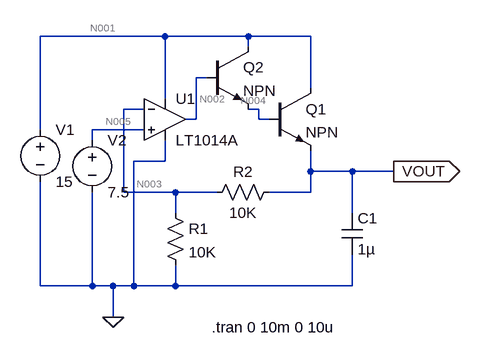
[diagram p0: schematic linear regulator.asc]
linear regulator.asc, the LTspice schematic file:
Version 4
SHEET 1 880 680
WIRE 192 16 0 16
WIRE 320 16 192 16
WIRE 416 16 320 16
WIRE 320 32 320 16
WIRE 256 80 240 80
WIRE 416 96 416 16
WIRE 192 112 192 16
WIRE 160 128 128 128
WIRE 336 128 320 128
WIRE 240 144 240 80
WIRE 240 144 224 144
WIRE 336 144 336 128
WIRE 352 144 336 144
WIRE 0 160 0 16
WIRE 160 160 80 160
WIRE 80 176 80 160
WIRE 192 208 192 176
WIRE 192 208 144 208
WIRE 416 224 416 192
WIRE 480 224 416 224
WIRE 544 224 480 224
WIRE 128 256 128 128
WIRE 208 256 128 256
WIRE 272 256 208 256
WIRE 416 256 416 224
WIRE 416 256 352 256
WIRE 208 288 208 256
WIRE 480 288 480 224
WIRE 0 400 0 240
WIRE 80 400 80 256
WIRE 80 400 0 400
WIRE 112 400 80 400
WIRE 144 400 144 208
WIRE 144 400 112 400
WIRE 208 400 208 368
WIRE 208 400 144 400
WIRE 480 400 480 352
WIRE 480 400 208 400
WIRE 112 448 112 400
FLAG 112 448 0
FLAG 544 224 VOUT
IOPIN 544 224 Out
SYMBOL Opamps\\LT1014A 192 80 R0
SYMATTR InstName U1
SYMBOL voltage 80 160 R0
WINDOW 123 0 0 Left 0
WINDOW 39 0 0 Left 0
SYMATTR InstName V2
SYMATTR Value 7.5
SYMBOL voltage 0 144 R0
WINDOW 123 0 0 Left 0
WINDOW 39 0 0 Left 0
SYMATTR InstName V1
SYMATTR Value 15
SYMBOL res 192 272 R0
SYMATTR InstName R1
SYMATTR Value 10K
SYMBOL res 368 240 R90
WINDOW 0 0 56 VBottom 2
WINDOW 3 32 56 VTop 2
SYMATTR InstName R2
SYMATTR Value 10K
SYMBOL npn 352 96 R0
SYMATTR InstName Q1
SYMBOL npn 256 32 R0
SYMATTR InstName Q2
SYMBOL cap 464 288 R0
SYMATTR InstName C1
SYMATTR Value 1µ
TEXT 264 464 Left 2 !.tran 0 10m 0 10u

The netlist it stands for:
* linear regulator.asc
XU1 N005 N003 N001 0 N002 LT1014A  ; pins In+ In- V+ V- OUT
V2 N005 0 7.5
V1 N001 0 15
R1 N003 0 10K
R2 VOUT N003 10K
Q1 N001 N004 VOUT 0 NPN
Q2 N001 N002 N004 0 NPN
C1 VOUT 0 1µ
.model NPN NPN
.model PNP PNP
.lib standard.bjt
.tran 0 10m 0 10u
.backanno
.end

* Results of the author's LTspice run, read from the files saved beside the schematic
* Operating Point, zero values left out:
*   V(n003) = 6.506 V
*   V(n005) = 7.5 V
*   V(n001) = 15 V
*   V(n002) = 14.42 V
*   V(vout) = 13.01 V
*   V(n004) = 13.78 V
*   Ic(Q2) = 6.378 µA
*   Ib(Q2) = 63.78 nA
*   Ie(Q2) = -6.442 µA
*   Ic(Q1) = 644.2 µA
*   Ib(Q1) = 6.442 µA
*   Ie(Q1) = -650.6 µA
*   I(R2) = 650.6 µA
*   I(R1) = 650.6 µA
*   I(V1) = -991 µA
*   I(V2) = 9.716 nA
*   Ix(u1:1) = -9.716 nA
*   Ix(u1:2) = -14.38 nA
*   Ix(u1:3) = 340.5 µA
*   Ix(u1:4) = -350 µA
*   Ix(u1:5) = -63.79 nA